# Altium schematic sheet baseControl.SchDoc
size A4
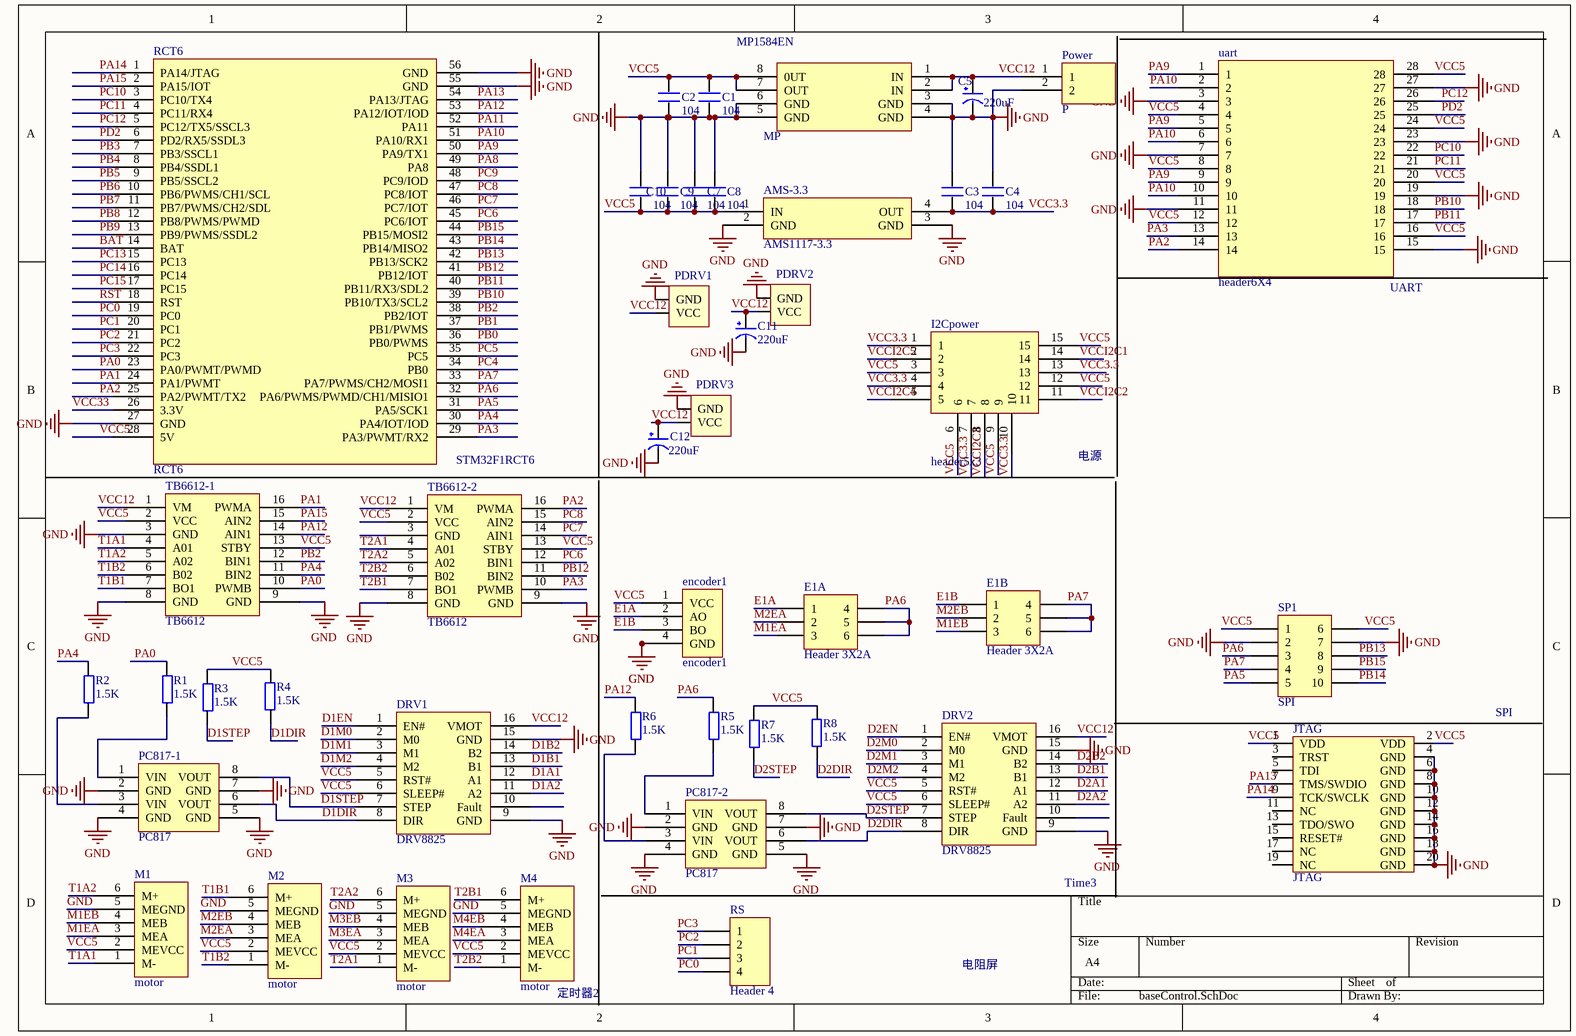
[diagram p0: baseControl.SchDoc]

## Parts
AMS-3.3  AMS1117-3.3  [AMS1117-3.3]
C1  104  [0603P]
C2  104  [0603P]
C3  104  [0603P]
C4  104  [0603P]
C5  220uF  [220 25V]
C7  104  [0805]
C8  104  [0805]
C9  104  [0805]
C10  104  [0805]
C11  220uF  [220 25V]
C12  220uF  [220 25V]
DRV1  DRV8825  [DRV8825]
DRV2  DRV8825  [DRV8825]
E1A  Header 3X2A  [HDR2X3_CEN]
E1B  Header 3X2A  [HDR2X3_CEN]
encoder1  encoder1  [XH-4-254]
I2Cpower  header5x3  [header5X3]
JTAG  JTAG  [JTAG_20]
M1  motor  [XH-6-254]
M2  motor  [XH-6-254]
M3  motor  [XH-6-254]
M4  motor  [XH-6-254]
MP  MP1584EN  [MP1584EN]
PC817-1  PC817  [DIP4]
PC817-2  PC817  [DIP4]
PDRV1  XH2.54-2P  [XH2.54-2P]  (value not drawn)
PDRV2  XH2.54-2P  [XH2.54-2P]  (value not drawn)
PDRV3  XH2.54-2P  [XH2.54-2P]  (value not drawn)
Power  P  [Power]
R1  1.5K  [0603P]
R2  1.5K  [0603P]
R3  1.5K  [0603P]
R4  1.5K  [0603P]
R5  1.5K  [0603P]
R6  1.5K  [0603P]
R7  1.5K  [0603P]
R8  1.5K  [0603P]
RCT6  RCT6  [STM32F1RCT6]
RS  Header 4  [HDR1X4]
SP1  SPI  [HDR2X5_CEN]
TB6612-1  TB6612  [TB6612]
TB6612-2  TB6612  [TB6612]
uart  header6X4  [header7X4]

## Nets
GND: AMS-3.3.2(GND) AMS-3.3.3(GND) C1.2 C2.2 C3.2 C4.2 C5.2(GND) C7.2 C8.2 C9.2 C10.2 C11.2(GND) C12.2(GND) DRV1.9(GND) DRV1.15(GND) DRV2.9(GND) DRV2.15(GND) encoder1.4(GND) JTAG.4(GND) JTAG.6(GND) JTAG.8(GND) JTAG.10(GND) JTAG.12(GND) JTAG.14(GND) JTAG.16(GND) JTAG.18(GND) JTAG.20(GND) M1.5(MEGND) M2.5(MEGND) M3.5(MEGND) M4.5(MEGND) MP.3(GND) MP.4(GND) MP.5(GND) MP.6(GND) PC817-1.2(GND) PC817-1.4(GND) PC817-1.5(GND) PC817-1.7(GND) PC817-2.2(GND) PC817-2.4(GND) PC817-2.5(GND) PC817-2.7(GND) PDRV1.1(GND) PDRV2.1(GND) PDRV3.1(GND) Power.2 RCT6.27(GND) RCT6.55(GND) RCT6.56(GND) SP1.2 SP1.7 TB6612-1.3(GND) TB6612-1.8(GND) TB6612-1.9(GND) TB6612-2.8(GND) TB6612-2.9(GND) uart.3 uart.7 uart.11 uart.15 uart.19 uart.23 uart.27
BAT: RCT6.14(BAT)
D1A1: DRV1.12(A1)
D1A2: DRV1.11(A2)
D1B1: DRV1.13(B1)
D1B2: DRV1.14(B2)
D1DIR: DRV1.8(DIR) PC817-1.6(VOUT) R4.2
D1EN: DRV1.1(EN#)
D1M0: DRV1.2(M0)
D1M1: DRV1.3(M1)
D1M2: DRV1.4(M2)
D1STEP: DRV1.7(STEP) PC817-1.8(VOUT) R3.1
D2A1: DRV2.12(A1)
D2A2: DRV2.11(A2)
D2B1: DRV2.13(B1)
D2B2: DRV2.14(B2)
D2DIR: DRV2.8(DIR) PC817-2.6(VOUT) R8.2
D2EN: DRV2.1(EN#)
D2M0: DRV2.2(M0)
D2M1: DRV2.3(M1)
D2M2: DRV2.4(M2)
D2STEP: DRV2.7(STEP) PC817-2.8(VOUT) R7.1
E1A: E1A.1 encoder1.2(AO)
E1B: E1B.1 encoder1.3(BO)
M1EA: E1A.3 M1.3(MEA)
M1EB: E1B.3 M1.4(MEB)
M2EA: E1A.2 M2.3(MEA)
M2EB: E1B.2 M2.4(MEB)
M3EA: M3.3(MEA)
M3EB: M3.4(MEB)
M4EA: M4.3(MEA)
M4EB: M4.4(MEB)
PA0: R1.2 RCT6.23(PA0/PWMT/PWMD) TB6612-1.10(PWMB)
PA1: RCT6.24(PA1/PWMT) TB6612-1.16(PWMA)
PA2: RCT6.25(PA2/PWMT/TX2) TB6612-2.16(PWMA) uart.14
PA3: RCT6.29(PA3/PWMT/RX2) TB6612-2.10(PWMB) uart.13
PA4: R2.2 RCT6.30(PA4/IOT/IOD) TB6612-1.11(BIN2)
PA5: RCT6.31(PA5/SCK1) SP1.5
PA6: E1A.4 E1A.5 E1A.6 R5.2 RCT6.32(PA6/PWMS/PWMD/CH1/MISIO1) SP1.3
PA7: E1B.4 E1B.5 E1B.6 RCT6.33(PA7/PWMS/CH2/MOSI1) SP1.4
PA8: RCT6.49(PA8)
PA9: RCT6.50(PA9/TX1) uart.1 uart.5 uart.9
PA10: RCT6.51(PA10/RX1) uart.2 uart.6 uart.10
PA11: RCT6.52(PA11)
PA12: R6.2 RCT6.53(PA12/IOT/IOD) TB6612-1.14(AIN1)
PA13: JTAG.7(TMS/SWDIO) RCT6.54(PA13/JTAG)
PA14: JTAG.9(TCK/SWCLK) RCT6.1(PA14/JTAG)
PA15: RCT6.2(PA15/IOT) TB6612-1.15(AIN2)
PB0: RCT6.36(PB0/PWMS)
PB1: RCT6.37(PB1/PWMS)
PB2: RCT6.38(PB2/IOT) TB6612-1.12(BIN1)
PB3: RCT6.7(PB3/SSCL1)
PB4: RCT6.8(PB4/SSDL1)
PB5: RCT6.9(PB5/SSCL2)
PB6: RCT6.10(PB6/PWMS/CH1/SCL)
PB7: RCT6.11(PB7/PWMS/CH2/SDL)
PB8: RCT6.12(PB8/PWMS/PWMD)
PB9: RCT6.13(PB9/PWMS/SSDL2)
PB10: RCT6.39(PB10/TX3/SCL2) uart.18
PB11: RCT6.40(PB11/RX3/SDL2) uart.17
PB12: RCT6.41(PB12/IOT) TB6612-2.11(BIN2)
PB13: RCT6.42(PB13/SCK2) SP1.8
PB14: RCT6.43(PB14/MISO2) SP1.10
PB15: RCT6.44(PB15/MOSI2) SP1.9
PC0: RCT6.19(PC0) RS.4
PC1: RCT6.20(PC1) RS.3
PC2: RCT6.21(PC2) RS.2
PC3: RCT6.22(PC3) RS.1
PC4: RCT6.34(PB0)
PC5: RCT6.35(PC5)
PC6: RCT6.45(PC6/IOT) TB6612-2.12(BIN1)
PC7: RCT6.46(PC7/IOT) TB6612-2.14(AIN1)
PC8: RCT6.47(PC8/IOT) TB6612-2.15(AIN2)
PC9: RCT6.48(PC9/IOD)
PC10: RCT6.3(PC10/TX4) uart.22
PC11: RCT6.4(PC11/RX4) uart.21
PC12: RCT6.5(PC12/TX5/SSCL3) uart.26
PC13: RCT6.15(PC13)
PC14: RCT6.16(PC14)
PC15: RCT6.17(PC15)
PD2: RCT6.6(PD2/RX5/SSDL3) uart.25
RST: RCT6.18(RST)
T1A1: M1.1(M-) TB6612-1.4(A01)
T1A2: M1.6(M+) TB6612-1.5(A02)
T1B1: M2.6(M+) TB6612-1.7(BO1)
T1B2: M2.1(M-) TB6612-1.6(B02)
T2A1: M3.1(M-) TB6612-2.4(A01)
T2A2: M3.6(M+) TB6612-2.5(A02)
T2B1: M4.6(M+) TB6612-2.7(BO1)
T2B2: M4.1(M-) TB6612-2.6(B02)
VCC3.3: AMS-3.3.4(OUT) C3.1 C4.1 I2Cpower.1 I2Cpower.4 I2Cpower.7 I2Cpower.10 I2Cpower.13
VCC5: AMS-3.3.1(IN) C1.1 C2.1 C7.1 C8.1 C9.1 C10.1 DRV1.5(RST#) DRV1.6(SLEEP#) DRV2.5(RST#) DRV2.6(SLEEP#) encoder1.1(VCC) I2Cpower.3 I2Cpower.6 I2Cpower.9 I2Cpower.12 I2Cpower.15 JTAG.1(VDD) JTAG.2(VDD) M1.2(MEVCC) M2.2(MEVCC) M3.2(MEVCC) M4.2(MEVCC) MP.7(OUT) MP.8(0UT) R3.2 R4.1 R7.2 R8.1 RCT6.28(5V) SP1.1 SP1.6 TB6612-1.2(VCC) TB6612-1.13(STBY) TB6612-2.2(VCC) TB6612-2.13(STBY) uart.4 uart.8 uart.12 uart.16 uart.20 uart.24 uart.28
VCC12: C5.1(VCC) C11.1(VCC) C12.1(VCC) DRV1.16(VMOT) DRV2.16(VMOT) MP.1(IN) MP.2(IN) PDRV1.2(VCC) PDRV2.2(VCC) PDRV3.2(VCC) Power.1 TB6612-1.1(VM) TB6612-2.1(VM)
VCC33: RCT6.26(3.3V)
VCCI2C1: I2Cpower.14
VCCI2C2: I2Cpower.11
VCCI2C3: I2Cpower.8
VCCI2C4: I2Cpower.5
VCCI2C5: I2Cpower.2
NetPC817-1_1: PC817-1.1(VIN) R1.1
NetPC817-1_3: PC817-1.3(VIN) R2.1
NetPC817-2_1: PC817-2.1(VIN) R5.1
NetPC817-2_3: PC817-2.3(VIN) R6.1

Not connected (* = marked no-connect by the designer): DRV1 10(Fault); DRV2 10(Fault); JTAG 3(TRST) 5(TDI) 11(NC) 13(TDO/SWO) 15(RESET#) 17(NC) 19(NC); TB6612-2 3(GND)

## Notes on the sheet
- (near uart) UART
- STM32F1RCT6
- 电源
- SPI
- (near DRV2) Time3
- 电阻屏
- (near M4) 定时器2

## Library data of the parts
C1-C4 C7-C10 = C
C5 C11 C12 = CAP
E1A E1B = Header 3X2A: Header, 3-Pin, Dual row; LatestRevisionDate: 17-Jul-2002; LatestRevisionNote: Re-released for DXP Platform.; Publisher: Altium Limited
encoder1 = encoder
JTAG = JTAG_20
M1-M4 = XH-6-254
Power = Power
R1-R8 = R
RCT6 = STM32F1RCT6
RS = Header 4: Header, 4-Pin; LatestRevisionDate: 17-Jul-2002; LatestRevisionNote: Re-released for DXP Platform.; Publisher: Altium Limited
SP1 = Header 5X2A: Header, 5-Pin, Dual row; LatestRevisionDate: 17-Jul-2002; LatestRevisionNote: Re-released for DXP Platform.; Publisher: Altium Limited